# Altium schematic sheet FPGA_51_External_Memory.SchDoc
size A; Organization: Altium Limited; Address1: L3, 12a Rodborough Rd; Address2: Frenchs Forest; Address3: NSW; Address4: Australia 2086; DocumentNumber: 1; SheetNumber: 1; SheetTotal: 2
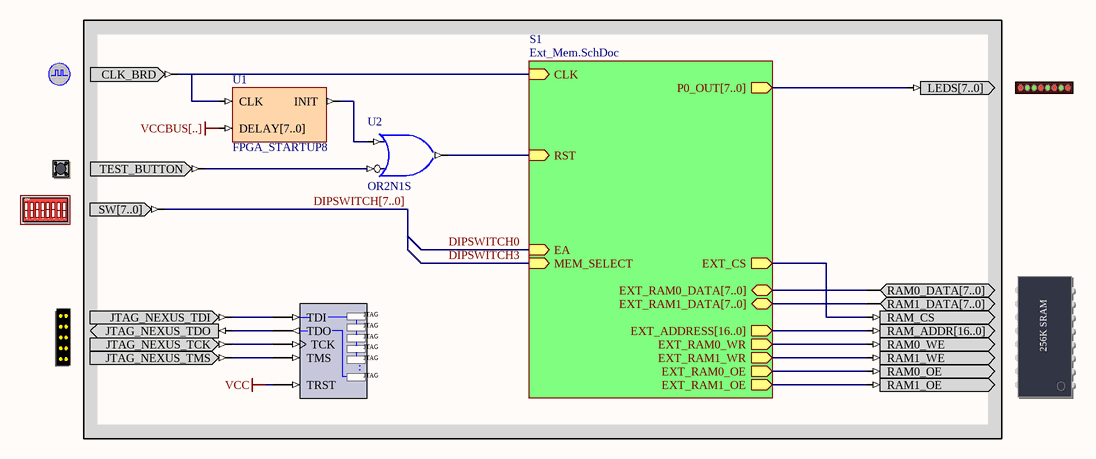
[diagram p0: FPGA_51_External_Memory.SchDoc]

## Parts
(Parts that share a designator on the sheet are numbered #1, #2 ... from top to bottom, then left to right.)
?#1  CLOCK_BOARD  (value not drawn)
?#2  LED  (value not drawn)
?#3  TEST_BUTTON  (value not drawn)
?#4  DIPSWITCH  (value not drawn)
?#5  MEMORY256KX8  (value not drawn)
?#6  NEXUS_JTAG_CONNECTOR  (value not drawn)
NEXUS_JTAG_PORT  NEXUS_JTAG_PORT  (value not drawn)
U1  FPGA_STARTUP8
U2  OR2N1S

## Sub-sheets
S1 = Ext_Mem.SchDoc: CLK (in), RST (in), EA (in), P0_OUT[7..0] (out), EXT_ADDRESS[16..0] (out), EXT_RAM1_DATA[7..0] (bidir), EXT_CS (out), EXT_RAM1_WR (out), EXT_RAM1_OE (out), EXT_RAM0_DATA[7..0] (bidir), EXT_RAM0_WR (out), EXT_RAM0_OE (out), MEM_SELECT (in)

## Nets
VCC: NEXUS_JTAG_PORT.TRST
VCCBUS[..]: U1.DELAY[7..0]
DIPSWITCH0: sheet S1/EA
DIPSWITCH3: sheet S1/MEM_SELECT
DIPSWITCH[7..0]: ?#4.SW[7..0]
Net?#1_CLK_BRD: ?#1.CLK_BRD U1.CLK ; sheet S1/CLK
Net?#2_LEDS[7..0]: ?#2.LEDS[7..0] ; sheet S1/P0_OUT[7..0]
Net?#3_TEST_BUTTON: ?#3.TEST_BUTTON U2.I0
Net?#5_RAM0_DATA[7..0]: ?#5.RAM0_DATA[7..0] ; sheet S1/EXT_RAM0_DATA[7..0]
Net?#5_RAM0_OE: ?#5.RAM0_OE ; sheet S1/EXT_RAM0_OE
Net?#5_RAM0_WE: ?#5.RAM0_WE ; sheet S1/EXT_RAM0_WR
Net?#5_RAM1_DATA[7..0]: ?#5.RAM1_DATA[7..0] ; sheet S1/EXT_RAM1_DATA[7..0]
Net?#5_RAM1_OE: ?#5.RAM1_OE ; sheet S1/EXT_RAM1_OE
Net?#5_RAM1_WE: ?#5.RAM1_WE ; sheet S1/EXT_RAM1_WR
Net?#5_RAM_ADDR[16..0]: ?#5.RAM_ADDR[16..0] ; sheet S1/EXT_ADDRESS[16..0]
Net?#5_RAM_CS: ?#5.RAM_CS ; sheet S1/EXT_CS
Net?#6_JTAG_NEXUS_TCK: ?#6.JTAG_NEXUS_TCK NEXUS_JTAG_PORT.TCK
Net?#6_JTAG_NEXUS_TDI: ?#6.JTAG_NEXUS_TDI NEXUS_JTAG_PORT.TDI
Net?#6_JTAG_NEXUS_TDO: ?#6.JTAG_NEXUS_TDO NEXUS_JTAG_PORT.TDO
Net?#6_JTAG_NEXUS_TMS: ?#6.JTAG_NEXUS_TMS NEXUS_JTAG_PORT.TMS
NetU1_INIT: U1.INIT U2.I1
NetU2_O: U2.O ; sheet S1/RST

## Buses and harness runs
bus DIPSWITCH[7..0]

## Notes on the sheet
- Title
- Size:
- Date:
- A
- Number:
- Time:
- Revision:
- Sheet
- of
- File:
- (in symbol DIPSWITCH) ON; 1; 2; 3; 4; 5; 6; 7; 8
- (in symbol MEMORY256KX8) 256K SRAM
- (in symbol NEXUS_JTAG_PORT) JTAG; .

## Library data of the parts
?#1 = CLOCK_BOARD: Global System Clock Supply; PortComponent: True; Published: 19-Nov-2003; Publisher: Altium Limited
?#2 = LED: 8-Way LEDS; PortComponent: True; Published: 19-Nov-2003; Publisher: Altium Limited
?#3 = TEST_BUTTON: Test Button; PortComponent: True; Published: 19-Nov-2003; Publisher: Altium Limited
?#4 = DIPSWITCH: 8-Way Dip Switch; PortComponent: True; Published: 19-Nov-2003; Publisher: Altium Limited
?#5 = MEMORY256KX8: SRAM 256kx8; PortComponent: True; Published: 19-Nov-2003; Publisher: Altium Limited
?#6 = NEXUS_JTAG_CONNECTOR: JTAG Port; PortComponent: True; Published: 19-Nov-2003; Publisher: Altium Limited
NEXUS_JTAG_PORT = NEXUS_JTAG_PORT: Soft Nexus-Chain Connector; NEXUS_JTAG_CONNECTOR: True; Published: 18-Dec-2003; Publisher: Altium Limited
U1 = FPGA_STARTUP8: FPGA Startup With 8 Bit Delay; Published: 21/01/2004; Publisher: Altium Hobart Technology Centre; Core Revision: 1.00.00
U2 = OR2N1S: 2-Input OR Gate with Active Low A Input, Single Pin Version; Xilinx Equivalent: OR2B1; ArchiveName: GENERIC; Published: 18-Dec-2003; Publisher: Altium Limited; Core Revision: 1.00.00